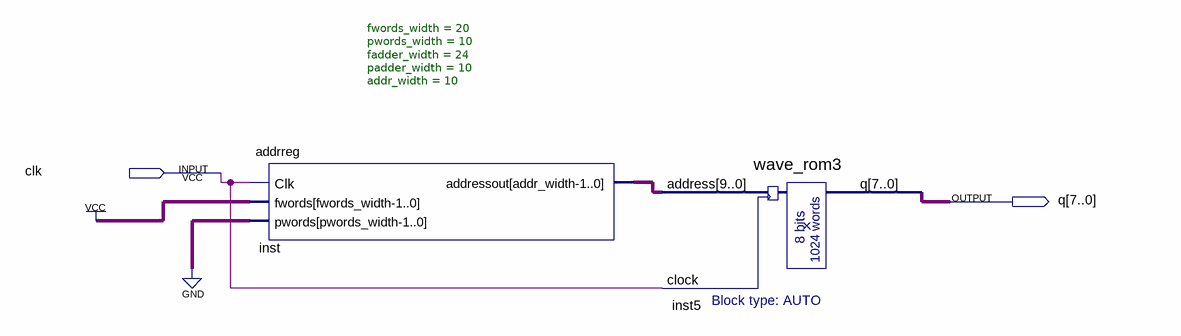
[diagram p0: schematic sheet]
// Quartus schematic dds_top3.bdf as structural Verilog: 2 symbols, 2 pins
module dds_top3 (
  input  clk,
  output [7:0] q
);

  wire [9:0] inst_addressout;

  addrreg #(.fwords_width(20), .pwords_width(10), .fadder_width(24), .padder_width(10), .addr_width(10)) inst (
    .Clk(clk), .fwords({20{1'b1}}), .pwords({10{1'b0}}), .addressout(inst_addressout));
  wave_rom3 inst5 (.address(inst_addressout), .clock(clk), .q(q));
endmodule
